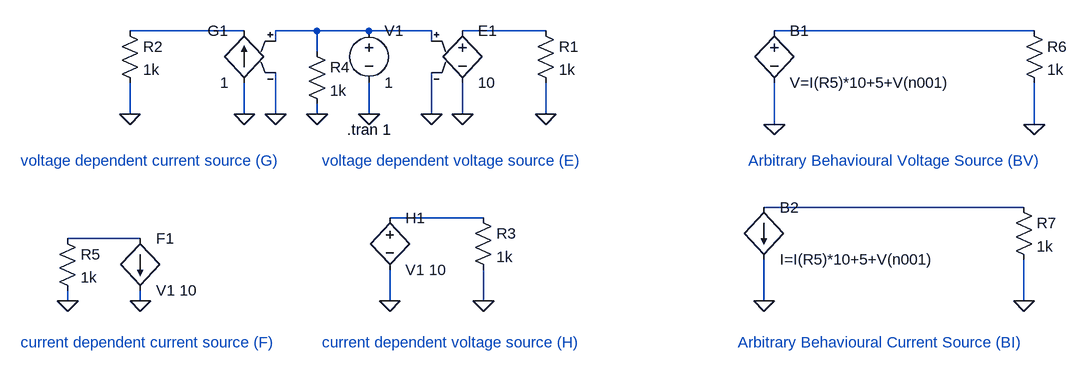
[diagram p0: schematic Draft1.asc]
Draft1.asc, the LTspice schematic file:
Version 4
SHEET 1 1324 680
WIRE 16 112 -160 112
WIRE 128 112 64 112
WIRE 208 112 128 112
WIRE 304 112 208 112
WIRE 480 112 352 112
WIRE 1232 112 832 112
WIRE 64 128 64 112
WIRE 304 128 304 112
WIRE 128 144 128 112
WIRE -160 240 -160 192
WIRE 16 240 16 192
WIRE 64 240 64 176
WIRE 128 240 128 224
WIRE 208 240 208 192
WIRE 304 240 304 176
WIRE 352 240 352 192
WIRE 480 240 480 192
WIRE 832 256 832 192
WIRE 1232 256 1232 192
WIRE 1216 384 816 384
WIRE 384 400 240 400
WIRE -144 432 -256 432
WIRE -256 528 -256 512
WIRE -144 528 -144 512
WIRE 240 528 240 480
WIRE 384 528 384 480
WIRE 816 528 816 464
WIRE 1216 528 1216 464
FLAG 208 240 0
FLAG 352 240 0
FLAG 480 240 0
FLAG 304 240 0
FLAG 16 240 0
FLAG 64 240 0
FLAG -160 240 0
FLAG 240 528 0
FLAG 384 528 0
FLAG 128 240 0
FLAG -144 528 0
FLAG -256 528 0
FLAG 832 256 0
FLAG 1232 256 0
FLAG 1216 528 0
FLAG 816 528 0
SYMBOL voltage 208 96 R0
WINDOW 123 0 0 Left 0
WINDOW 39 0 0 Left 0
SYMATTR InstName V1
SYMATTR Value 1
SYMBOL e 352 96 R0
SYMATTR InstName E1
SYMATTR Value 10
SYMBOL res 464 96 R0
SYMATTR InstName R1
SYMATTR Value 1k
SYMBOL g 16 96 M0
SYMATTR InstName G1
SYMATTR Value 1
SYMBOL res -176 96 R0
SYMATTR InstName R2
SYMATTR Value 1k
SYMBOL h 240 384 R0
SYMATTR InstName H1
SYMATTR Value V1 10
SYMBOL res 368 384 R0
SYMATTR InstName R3
SYMATTR Value 1k
SYMBOL res 112 128 R0
SYMATTR InstName R4
SYMATTR Value 1k
SYMBOL f -144 432 R0
SYMATTR InstName F1
SYMATTR Value V1 10
SYMBOL res -272 416 R0
SYMATTR InstName R5
SYMATTR Value 1k
SYMBOL bv 832 96 R0
SYMATTR InstName B1
SYMATTR Value V=I(R5)*10+5+V(n001)
SYMBOL res 1216 96 R0
SYMATTR InstName R6
SYMATTR Value 1k
SYMBOL bi 816 384 R0
SYMATTR InstName B2
SYMATTR Value I=I(R5)*10+5+V(n001)
SYMBOL res 1200 368 R0
SYMATTR InstName R7
SYMATTR Value 1k
TEXT 174 264 Left 2 !.tran 1
TEXT 136 312 Left 2 ;voltage dependent voltage source (E)
TEXT -328 312 Left 2 ;voltage dependent current source (G)
TEXT 136 592 Left 2 ;current dependent voltage source (H)
TEXT -328 592 Left 2 ;current dependent current source (F)
TEXT 792 312 Left 2 ;Arbitrary Behavioural Voltage Source (BV)
TEXT 776 592 Left 2 ;Arbitrary Behavioural Current Source (BI)

The netlist it stands for:
* Draft1.asc
V1 N002 0 1
E1 N003 0 N002 0 10
R1 N003 0 1k
G1 0 N001 N002 0 1
R2 N001 0 1k
H1 N006 0 V1 10
R3 N006 0 1k
R4 N002 0 1k
F1 N007 0 V1 10
R5 N007 0 1k
B1 N004 0 V=I(R5)*10+5+V(n001)
R6 N004 0 1k
B2 N005 0 I=I(R5)*10+5+V(n001)
R7 N005 0 1k
.tran 1
* voltage dependent voltage source (E)
* voltage dependent current source (G)
* current dependent voltage source (H)
* current dependent current source (F)
* Arbitrary Behavioural Voltage Source (BV)
* Arbitrary Behavioural Current Source (BI)
.backanno
.end